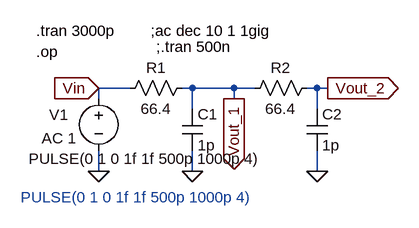
[diagram p0: schematic Delay_cell_2.asc]
Delay_cell_2.asc, the LTspice schematic file:
Version 4
SHEET 1 880 680
WIRE 144 64 96 64
WIRE 240 64 224 64
WIRE 304 64 240 64
WIRE 336 64 304 64
WIRE 432 64 416 64
WIRE 448 64 432 64
WIRE 96 80 96 64
WIRE 304 80 304 64
WIRE 240 96 240 64
WIRE 432 96 432 64
WIRE 96 192 96 160
WIRE 240 192 240 160
WIRE 432 192 432 160
FLAG 240 192 0
FLAG 96 64 Vin
IOPIN 96 64 In
FLAG 448 64 Vout_2
IOPIN 448 64 Out
FLAG 432 192 0
FLAG 304 80 Vout_1
IOPIN 304 80 Out
FLAG 96 192 0
SYMBOL cap 224 96 R0
SYMATTR InstName C1
SYMATTR Value 1p
SYMBOL res 240 48 R90
WINDOW 0 0 56 VBottom 2
WINDOW 3 32 56 VTop 2
SYMATTR InstName R1
SYMATTR Value 66.4
SYMBOL voltage 96 64 R0
WINDOW 3 -108 109 Left 2
WINDOW 123 -88 77 Left 2
WINDOW 39 0 0 Left 0
WINDOW 0 -76 41 Left 2
SYMATTR Value PULSE(0 1 0 1f 1f 500p 1000p 4)
SYMATTR Value2 AC 1
SYMATTR InstName V1
SYMBOL cap 416 96 R0
SYMATTR InstName C2
SYMATTR Value 1p
SYMBOL res 432 48 R90
WINDOW 0 0 56 VBottom 2
WINDOW 3 32 56 VTop 2
SYMATTR InstName R2
SYMATTR Value 66.4
TEXT 0 8 Left 2 !.op
TEXT 0 -24 Left 2 !.tran 3000p
TEXT -24 232 Left 2 ;PULSE(0 1 0 1f 1f 500p 1000p 4)
TEXT 176 -24 Left 2 !;ac dec 10 1 1gig
TEXT 184 0 Left 2 !;.tran 500n

The netlist it stands for:
* Delay_cell_2.asc
C1 Vout_1 0 1p
R1 Vout_1 Vin 66.4
V1 Vin 0 PULSE(0 1 0 1f 1f 500p 1000p 4) AC 1
C2 Vout_2 0 1p
R2 Vout_2 Vout_1 66.4
.op
.tran 3000p
* PULSE(0 1 0 1f 1f 500p 1000p 4)
;ac dec 10 1 1gig
;.tran 500n
.backanno
.end